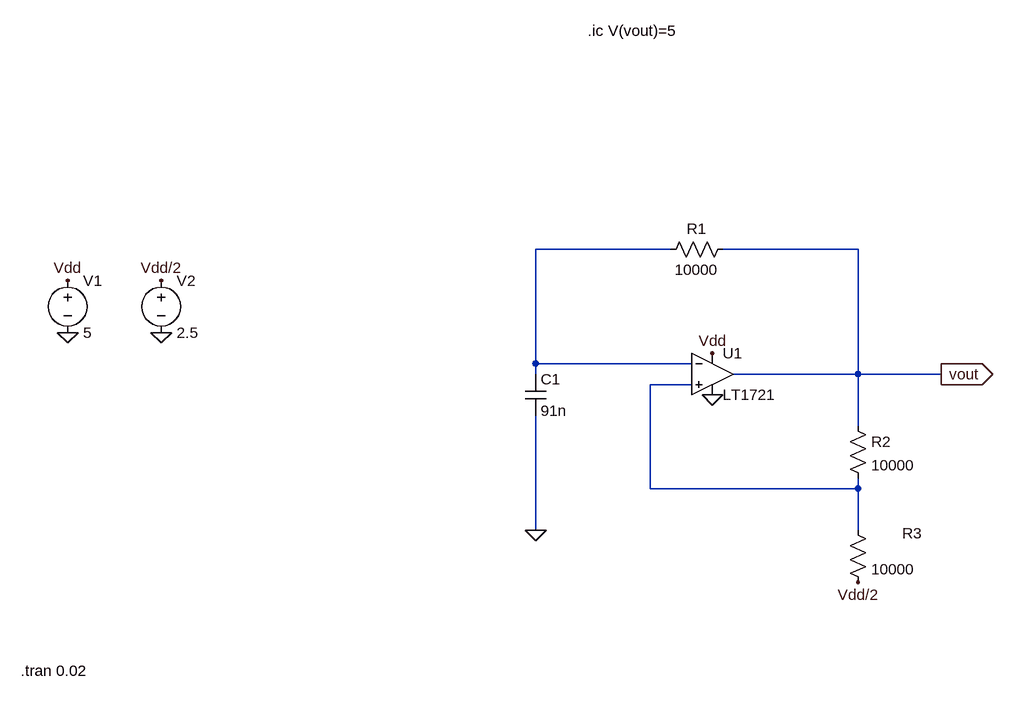
[diagram p0: schematic relaxation_osscilator.asc]
relaxation_osscilator.asc, the LTspice schematic file:
Version 4
SHEET 1 880 680
WIRE 320 -48 112 -48
WIRE 608 -48 400 -48
WIRE 112 128 112 -48
WIRE 352 128 112 128
WIRE 112 144 112 128
WIRE 608 144 608 -48
WIRE 608 144 416 144
WIRE 736 144 608 144
WIRE 352 160 288 160
WIRE 608 224 608 144
WIRE 288 320 288 160
WIRE 608 320 608 304
WIRE 608 320 288 320
WIRE 112 384 112 208
WIRE 608 384 608 320
FLAG 384 176 0
FLAG -608 0 Vdd
FLAG -464 0 Vdd/2
FLAG 112 384 0
FLAG 384 112 Vdd
FLAG 608 464 Vdd/2
FLAG 736 144 vout
IOPIN 736 144 Out
FLAG -608 80 0
FLAG -464 80 0
SYMBOL cap 96 144 R0
SYMATTR InstName C1
SYMATTR Value 91n
SYMBOL Comparators\\LT1721 384 80 R0
SYMATTR InstName U1
SYMBOL res 416 -64 R90
WINDOW 0 0 56 VBottom 2
WINDOW 3 32 56 VTop 2
SYMATTR InstName R1
SYMATTR Value 10000
SYMBOL res 592 208 R0
SYMATTR InstName R2
SYMATTR Value 10000
SYMBOL res 592 368 R0
WINDOW 0 84 21 Left 2
SYMATTR InstName R3
SYMATTR Value 10000
SYMBOL voltage -608 -16 R0
WINDOW 123 0 0 Left 0
WINDOW 39 0 0 Left 0
SYMATTR InstName V1
SYMATTR Value 5
SYMBOL voltage -464 -16 R0
WINDOW 123 0 0 Left 0
WINDOW 39 0 0 Left 0
SYMATTR InstName V2
SYMATTR Value 2.5
TEXT -680 600 Left 2 !.tran 0.02
TEXT 192 -384 Left 2 !.ic V(vout)=5

The netlist it stands for:
* relaxation_osscilator.asc
C1 N001 0 91n
XU1 N002 N001 Vdd 0 vout LT1720  ; LT1721, pins In+ In- V+ V- OUT
R1 vout N001 10000
R2 vout N002 10000
R3 N002 Vdd/2 10000
V1 Vdd 0 5
V2 Vdd/2 0 2.5
.tran 0.02
.ic V(vout)=5
.lib LTC.lib
.backanno
.end